# EAGLE design CCM_0020_two_channel_translator (EAGLE 9.5.1)

## Sheet 1 of 3: channel 1
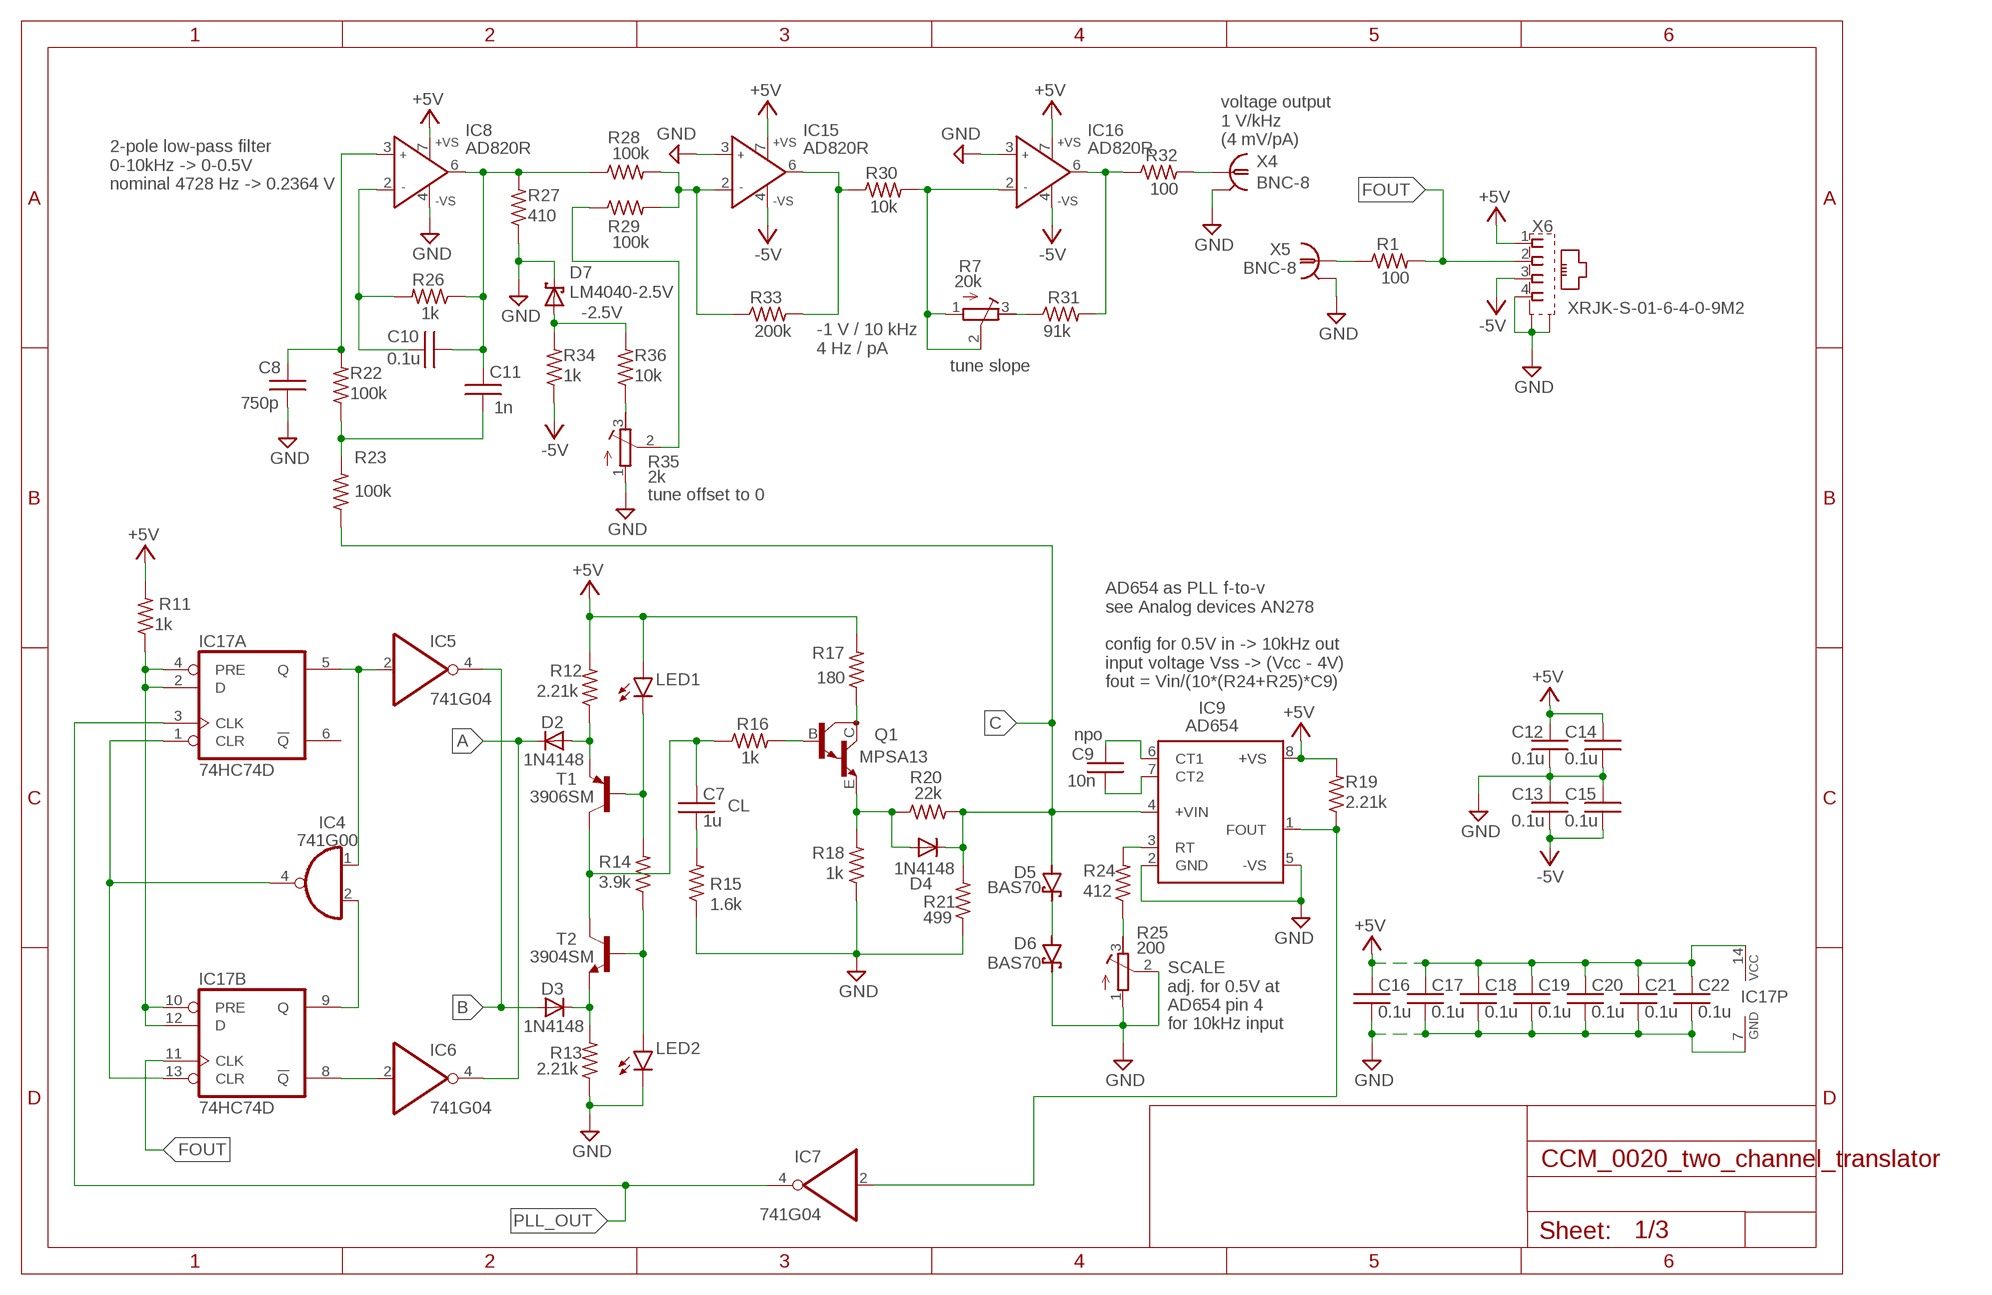
[diagram p0: schematic, sheet 1]

### Parts
C7  1u  C0603  [0603]
C8  750p  C0603  [0603]
C9  10n  C0603  [0603]
C10  0.1u  C0603  [0603]
C11  1n  C0603  [0603]
C12  0.1u  C0603  [0603]
C13  0.1u  C0603  [0603]
C14  0.1u  C0603  [0603]
C15  0.1u  C0603  [0603]
C16  0.1u  C0603  [0603]
C17  0.1u  C0603  [0603]
C18  0.1u  C0603  [0603]
C19  0.1u  C0603  [0603]
C20  0.1u  C0603  [0603]
C21  0.1u  C0603  [0603]
C22  0.1u  C0603  [0603]
D2  1N4148  [SOD323_ST]
D3  1N4148  [SOD323_ST]
D4  1N4148  [SOD323_ST]
D5  BAS70  [SOT23]
D6  BAS70  [SOT23]
D7  LM4040-2.5V  LM4040  [SOT23]
IC4  741G00  74AHC1G00DBV  [SOT23-5]
IC5  741G04  74AHC1G04DBV  [SOT23-5]
IC6  741G04  74AHC1G04DBV  [SOT23-5]
IC7  741G04  74AHC1G04DBV  [SOT23-5]
IC8  AD820R  [SO8]
IC9  AD654  [SO08]
IC15  AD820R  [SO8]
IC16  AD820R  [SO8]
IC17  74HC74D  [SO14]
LED1  LEDCHIP-LED0603  [CHIP-LED0603]
LED2  LEDCHIP-LED0603  [CHIP-LED0603]
Q1  MPSA13  MMBTA13LT1  [SOT23-BEC]
R1  100  R0603  [0603]
R7  20k  R-TRIMM64Y  [RTRIM64Y]
R11  1k  R0603  [0603]
R12  2.21k  R0603  [0603]
R13  2.21k  R0603  [0603]
R14  3.9k  R0603  [0603]
R15  1.6k  R0603  [0603]
R16  1k  R0603  [0603]
R17  180  R0603  [0603]
R18  1k  R0603  [0603]
R19  2.21k  R0603  [0603]
R20  22k  R0603  [0603]
R21  499  R0603  [0603]
R22  100k  R0603  [0603]
R23  100k  R0603  [0603]
R24  412  R0603  [0603]
R25  200  R-TRIMM64Y  [RTRIM64Y]
R26  1k  R0603  [0603]
R27  410  R0603  [0603]
R28  100k  R0603  [0603]
R29  100k  R0603  [0603]
R30  10k  R0603  [0603]
R31  91k  R0603  [0603]
R32  100  R0603  [0603]
R33  200k  R0603  [0603]
R34  1k  R0603  [0603]
R35  2k  R-TRIMM64Y  [RTRIM64Y]
R36  10k  R0603  [0603]
T1  3906SM  MMBT3906LT1-PNP-SOT23-BEC  [SOT23-BEC]
T2  3904SM  [SOT23]
X4  BNC-8  [BNC_RA]
X5  BNC-8  [BNC_RA]
X6  XRJK-S-01-6-4-0-9M2  [XRJK-S-01-6-4-0-9M2]

### Nets
+5V: C12.2 C14.2 C16.1 C17.1 C18.1 C19.1 C20.1 C21.1 C22.1 IC8.7(+VS) IC9.8(+VS) IC15.7(+VS) IC16.7(+VS) IC17.14(P:VCC) LED1.A R11.2 R12.2 R17.2 R19.2 X6.1 ; also sheet 2,3
-5V: C13.1 C15.1 IC15.4(-VS) IC16.4(-VS) R34.1 X6.3 ; also sheet 2,3
A: D2.C IC6.4(O)
B: D3.A IC5.4(O)
C: D4.C D5.1(A) IC9.4(+VIN) R20.2 R21.2 R23.1
FOUT: IC17.11(B:CLK) R1.2 X6.2
GND: C8.1 C12.1 C13.2 C14.1 C15.2 C16.2 C17.2 C18.2 C19.2 C20.2 C21.2 C22.2 D6.3(C) D7.1(C) IC8.4(-VS) IC9.2(GND) IC9.5(-VS) IC15.3(IN+) IC16.3(IN+) IC17.7(P:GND) LED2.C R13.1 R15.1 R18.1 R21.1 R25.1(A) R25.2(S) R27.1 R35.1(A) X4.2 X5.2 X6.4 X6.S1(S) X6.S2(S) ; also sheet 2,3
N$1: C9.1 IC9.6(CT1)
N$2: R1.1 X5.1
N$7: IC4.4(O) IC17.1(A:CLR) IC17.13(B:CLR)
N$9: R7.3(E) R31.1
N$10: IC4.2(I1) IC17.9(B:Q)
N$12: IC6.2(I) IC17.8(B:!Q)
N$13: C11.1 R22.1 R23.2
N$15: IC4.1(I0) IC5.2(I) IC17.5(A:Q)
N$16: C8.2 IC8.3(IN+) R22.2
N$17: C9.2 IC9.7(CT2)
N$18: R24.1 R25.3(E)
N$19: D5.3(C) D6.1(A)
N$20: C7.1 R16.1 T1.C T2.3(C)
N$21: D3.C R13.2 T2.2(E)
N$23: LED1.C R14.2 T1.B
N$24: LED2.A R14.1 T2.1(B)
N$25: C7.2 R15.2
N$26: Q1.C R17.1
N$27: Q1.B R16.2
N$28: D4.A Q1.E R18.2 R20.1
N$29: IC9.3(RT) R24.2
N$30: IC7.2(I) IC9.1(FOUT) R19.1
N$31: C10.2 C11.2 IC8.6(OUT) R26.1 R27.2 R28.1
N$32: C10.1 IC8.2(IN-) R26.2
N$33: IC15.2(IN-) R28.2 R29.2 R33.1
N$34: IC16.6(OUT) R31.2 R32.1
N$35: IC16.2(IN-) R7.1(A) R7.2(S) R30.2
N$36: R32.2 X4.1
N$37: IC15.6(OUT) R30.1 R33.2
N$38: D7.2(A) R34.2 R36.2
N$39: R29.1 R35.2(S)
N$40: R35.3(E) R36.1
N$41: D2.A R12.1 T1.E
N$69: IC17.2(A:D) IC17.4(A:PRE) IC17.10(B:PRE) IC17.12(B:D) R11.1
PLL_OUT: IC7.4(O) IC17.3(A:CLK)
Unconnected: IC17.6(A:!Q)

### Notes on the sheet
- voltage output
  1 V/kHz
  (4 mV/pA)
- 2-pole low-pass filter
  0-10kHz -> 0-0.5V
  nominal 4728 Hz -> 0.2364 V
- -2.5V
- -1 V / 10 kHz
  4 Hz / pA
- tune slope
- tune offset to 0
- AD654 as PLL f-to-v
  see Analog devices AN278
  
  config for 0.5V in -> 10kHz out
  input voltage Vss -> (Vcc - 4V)
  fout = Vin/(10*(R24+R25)*C9)
- npo
- CL
- SCALE
  adj. for 0.5V at 
  AD654 pin 4
  for 10kHz input

## Sheet 2 of 3: channel 2
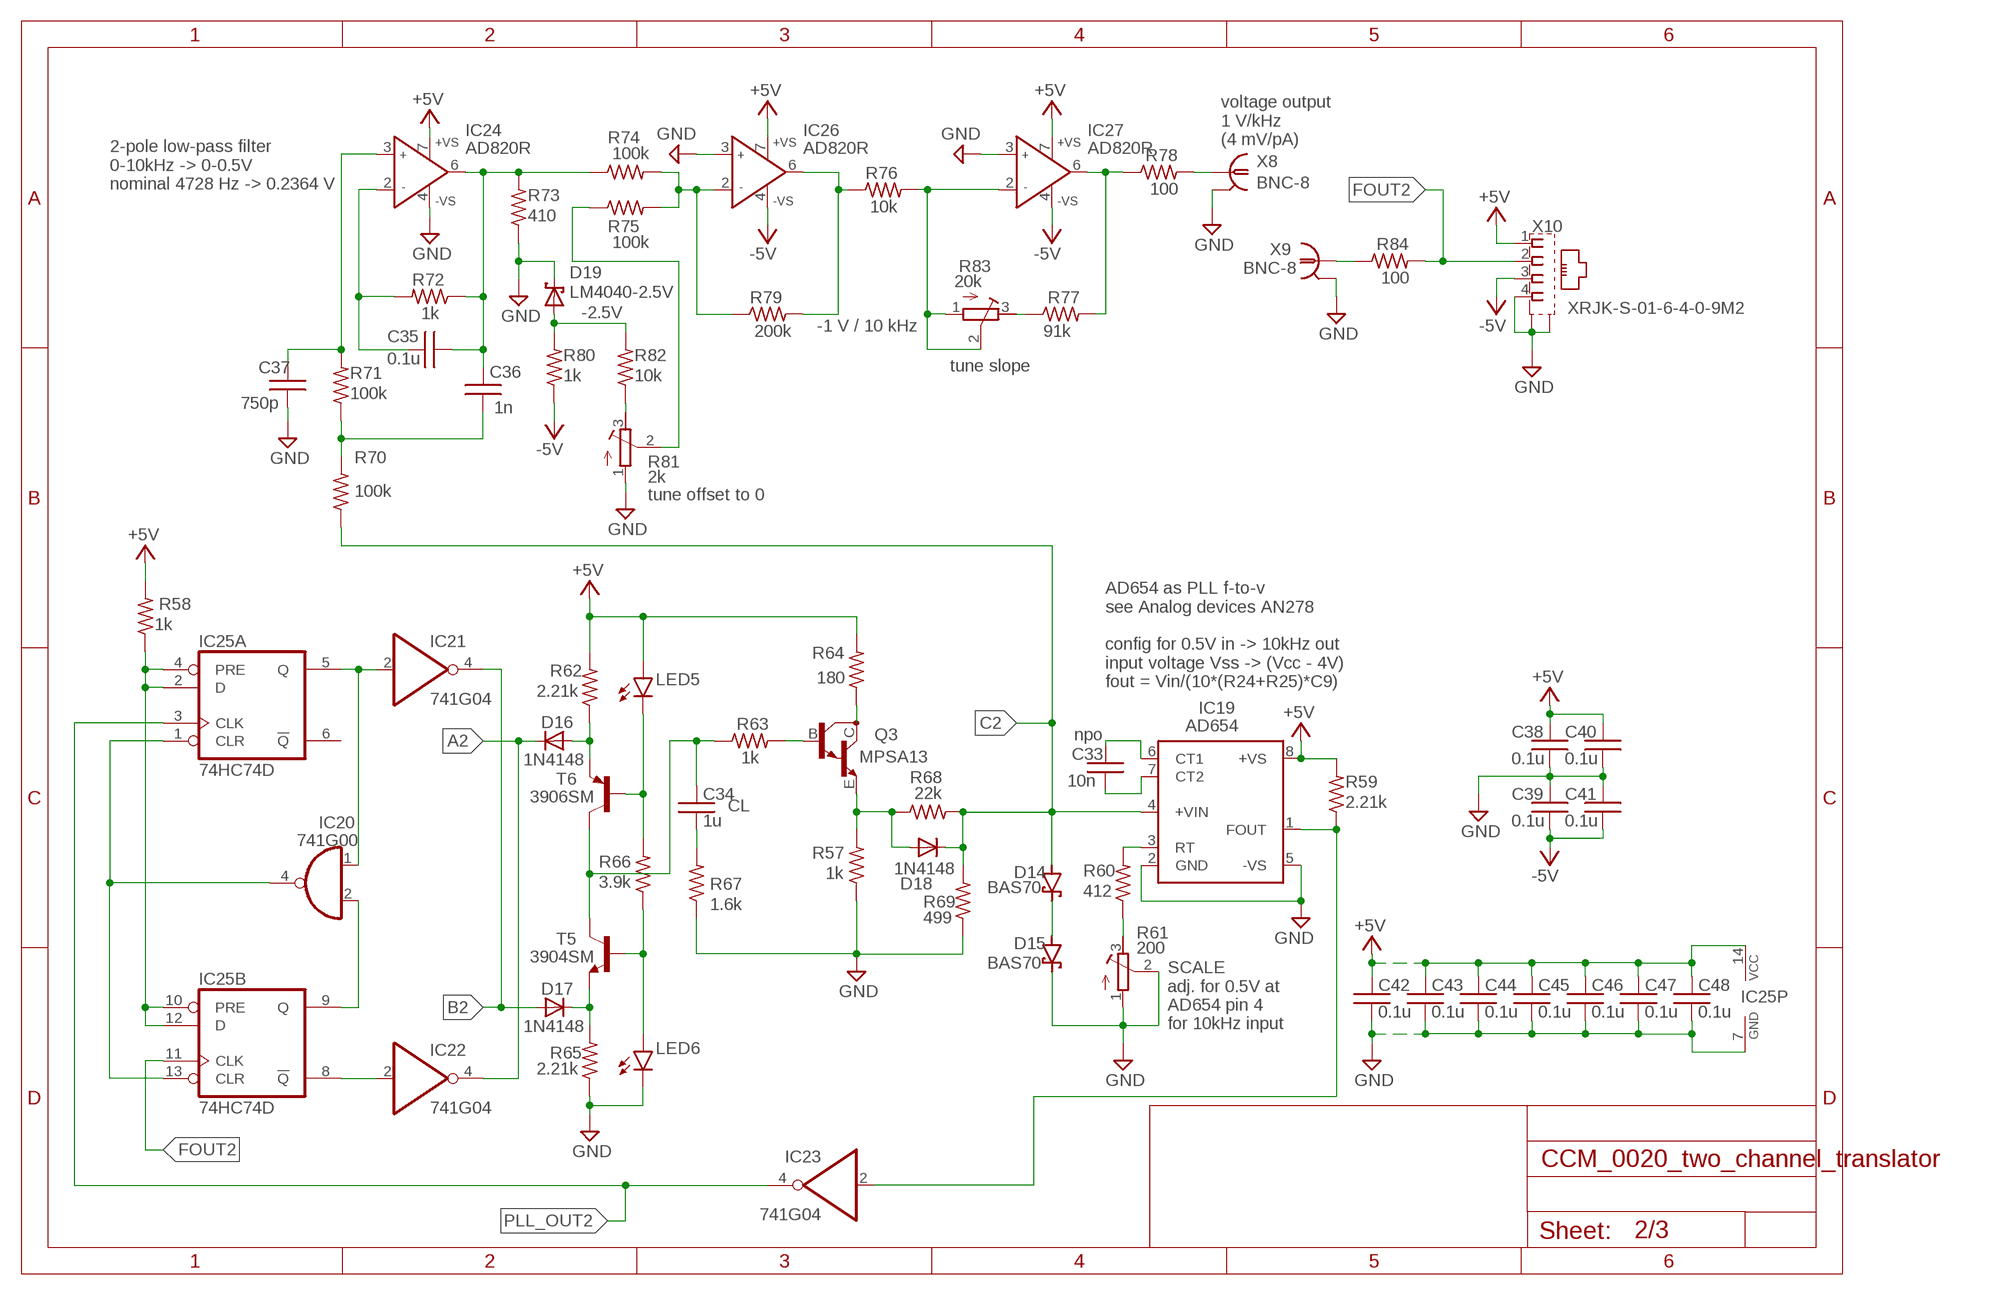
[diagram p1: schematic, sheet 2]

### Parts
C33  10n  C0603  [0603]
C34  1u  C0603  [0603]
C35  0.1u  C0603  [0603]
C36  1n  C0603  [0603]
C37  750p  C0603  [0603]
C38  0.1u  C0603  [0603]
C39  0.1u  C0603  [0603]
C40  0.1u  C0603  [0603]
C41  0.1u  C0603  [0603]
C42  0.1u  C0603  [0603]
C43  0.1u  C0603  [0603]
C44  0.1u  C0603  [0603]
C45  0.1u  C0603  [0603]
C46  0.1u  C0603  [0603]
C47  0.1u  C0603  [0603]
C48  0.1u  C0603  [0603]
D14  BAS70  [SOT23]
D15  BAS70  [SOT23]
D16  1N4148  [SOD323_ST]
D17  1N4148  [SOD323_ST]
D18  1N4148  [SOD323_ST]
D19  LM4040-2.5V  LM4040  [SOT23]
IC19  AD654  [SO08]
IC20  741G00  74AHC1G00DBV  [SOT23-5]
IC21  741G04  74AHC1G04DBV  [SOT23-5]
IC22  741G04  74AHC1G04DBV  [SOT23-5]
IC23  741G04  74AHC1G04DBV  [SOT23-5]
IC24  AD820R  [SO8]
IC25  74HC74D  [SO14]
IC26  AD820R  [SO8]
IC27  AD820R  [SO8]
LED5  LEDCHIP-LED0603  [CHIP-LED0603]
LED6  LEDCHIP-LED0603  [CHIP-LED0603]
Q3  MPSA13  MMBTA13LT1  [SOT23-BEC]
R57  1k  R0603  [0603]
R58  1k  R0603  [0603]
R59  2.21k  R0603  [0603]
R60  412  R0603  [0603]
R61  200  R-TRIMM64Y  [RTRIM64Y]
R62  2.21k  R0603  [0603]
R63  1k  R0603  [0603]
R64  180  R0603  [0603]
R65  2.21k  R0603  [0603]
R66  3.9k  R0603  [0603]
R67  1.6k  R0603  [0603]
R68  22k  R0603  [0603]
R69  499  R0603  [0603]
R70  100k  R0603  [0603]
R71  100k  R0603  [0603]
R72  1k  R0603  [0603]
R73  410  R0603  [0603]
R74  100k  R0603  [0603]
R75  100k  R0603  [0603]
R76  10k  R0603  [0603]
R77  91k  R0603  [0603]
R78  100  R0603  [0603]
R79  200k  R0603  [0603]
R80  1k  R0603  [0603]
R81  2k  R-TRIMM64Y  [RTRIM64Y]
R82  10k  R0603  [0603]
R83  20k  R-TRIMM64Y  [RTRIM64Y]
R84  100  R0603  [0603]
T5  3904SM  [SOT23]
T6  3906SM  MMBT3906LT1-PNP-SOT23-BEC  [SOT23-BEC]
X8  BNC-8  [BNC_RA]
X9  BNC-8  [BNC_RA]
X10  XRJK-S-01-6-4-0-9M2  [XRJK-S-01-6-4-0-9M2]

### Nets
+5V: C38.2 C40.2 C42.1 C43.1 C44.1 C45.1 C46.1 C47.1 C48.1 IC19.8(+VS) IC24.7(+VS) IC25.14(P:VCC) IC26.7(+VS) IC27.7(+VS) LED5.A R58.2 R59.2 R62.2 R64.2 X10.1 ; also sheet 1,3
-5V: C39.1 C41.1 IC26.4(-VS) IC27.4(-VS) R80.1 X10.3 ; also sheet 1,3
A2: D16.C IC22.4(O)
B2: D17.A IC21.4(O)
C2: D14.1(A) D18.C IC19.4(+VIN) R68.2 R69.2 R70.1
FOUT2: IC25.11(B:CLK) R84.2 X10.2
GND: C37.1 C38.1 C39.2 C40.1 C41.2 C42.2 C43.2 C44.2 C45.2 C46.2 C47.2 C48.2 D15.3(C) D19.1(C) IC19.2(GND) IC19.5(-VS) IC24.4(-VS) IC25.7(P:GND) IC26.3(IN+) IC27.3(IN+) LED6.C R57.1 R61.1(A) R61.2(S) R65.1 R67.1 R69.1 R73.1 R81.1(A) X8.2 X9.2 X10.4 X10.S1(S) X10.S2(S) ; also sheet 1,3
N$68: IC20.4(O) IC25.1(A:CLR) IC25.13(B:CLR)
N$70: IC20.2(I1) IC25.9(B:Q)
N$71: IC22.2(I) IC25.8(B:!Q)
N$72: IC20.1(I0) IC21.2(I) IC25.5(A:Q)
N$73: R60.1 R61.3(E)
N$74: D14.3(C) D15.1(A)
N$75: C34.1 R63.1 T5.3(C) T6.C
N$76: D17.C R65.2 T5.2(E)
N$77: LED5.C R66.2 T6.B
N$78: LED6.A R66.1 T5.1(B)
N$79: C34.2 R67.2
N$80: Q3.C R64.1
N$81: Q3.B R63.2
N$82: D18.A Q3.E R57.2 R68.1
N$83: IC19.3(RT) R60.2
N$84: C33.1 IC19.6(CT1)
N$85: C33.2 IC19.7(CT2)
N$86: IC19.1(FOUT) IC23.2(I) R59.1
N$87: C36.1 R70.2 R71.1
N$88: C37.2 IC24.3(IN+) R71.2
N$89: C35.2 C36.2 IC24.6(OUT) R72.1 R73.2 R74.1
N$90: C35.1 IC24.2(IN-) R72.2
N$91: IC26.2(IN-) R74.2 R75.2 R79.1
N$92: IC27.2(IN-) R76.2 R83.1(A) R83.2(S)
N$93: IC27.6(OUT) R77.2 R78.1
N$94: R78.2 X8.1
N$95: IC26.6(OUT) R76.1 R79.2
N$96: D19.2(A) R80.2 R82.2
N$97: R75.1 R81.2(S)
N$98: R81.3(E) R82.1
N$99: R77.1 R83.3(E)
N$100: D16.A R62.1 T6.E
N$101: R84.1 X9.1
N$102: IC25.2(A:D) IC25.4(A:PRE) IC25.10(B:PRE) IC25.12(B:D) R58.1
PLL_OUT2: IC23.4(O) IC25.3(A:CLK)
Unconnected: IC25.6(A:!Q)

### Notes on the sheet
- voltage output
  1 V/kHz
  (4 mV/pA)
- 2-pole low-pass filter
  0-10kHz -> 0-0.5V
  nominal 4728 Hz -> 0.2364 V
- -2.5V
- -1 V / 10 kHz
- tune slope
- tune offset to 0
- AD654 as PLL f-to-v
  see Analog devices AN278
  
  config for 0.5V in -> 10kHz out
  input voltage Vss -> (Vcc - 4V)
  fout = Vin/(10*(R24+R25)*C9)
- npo
- CL
- SCALE
  adj. for 0.5V at 
  AD654 pin 4
  for 10kHz input

## Sheet 3 of 3: rack mount bus
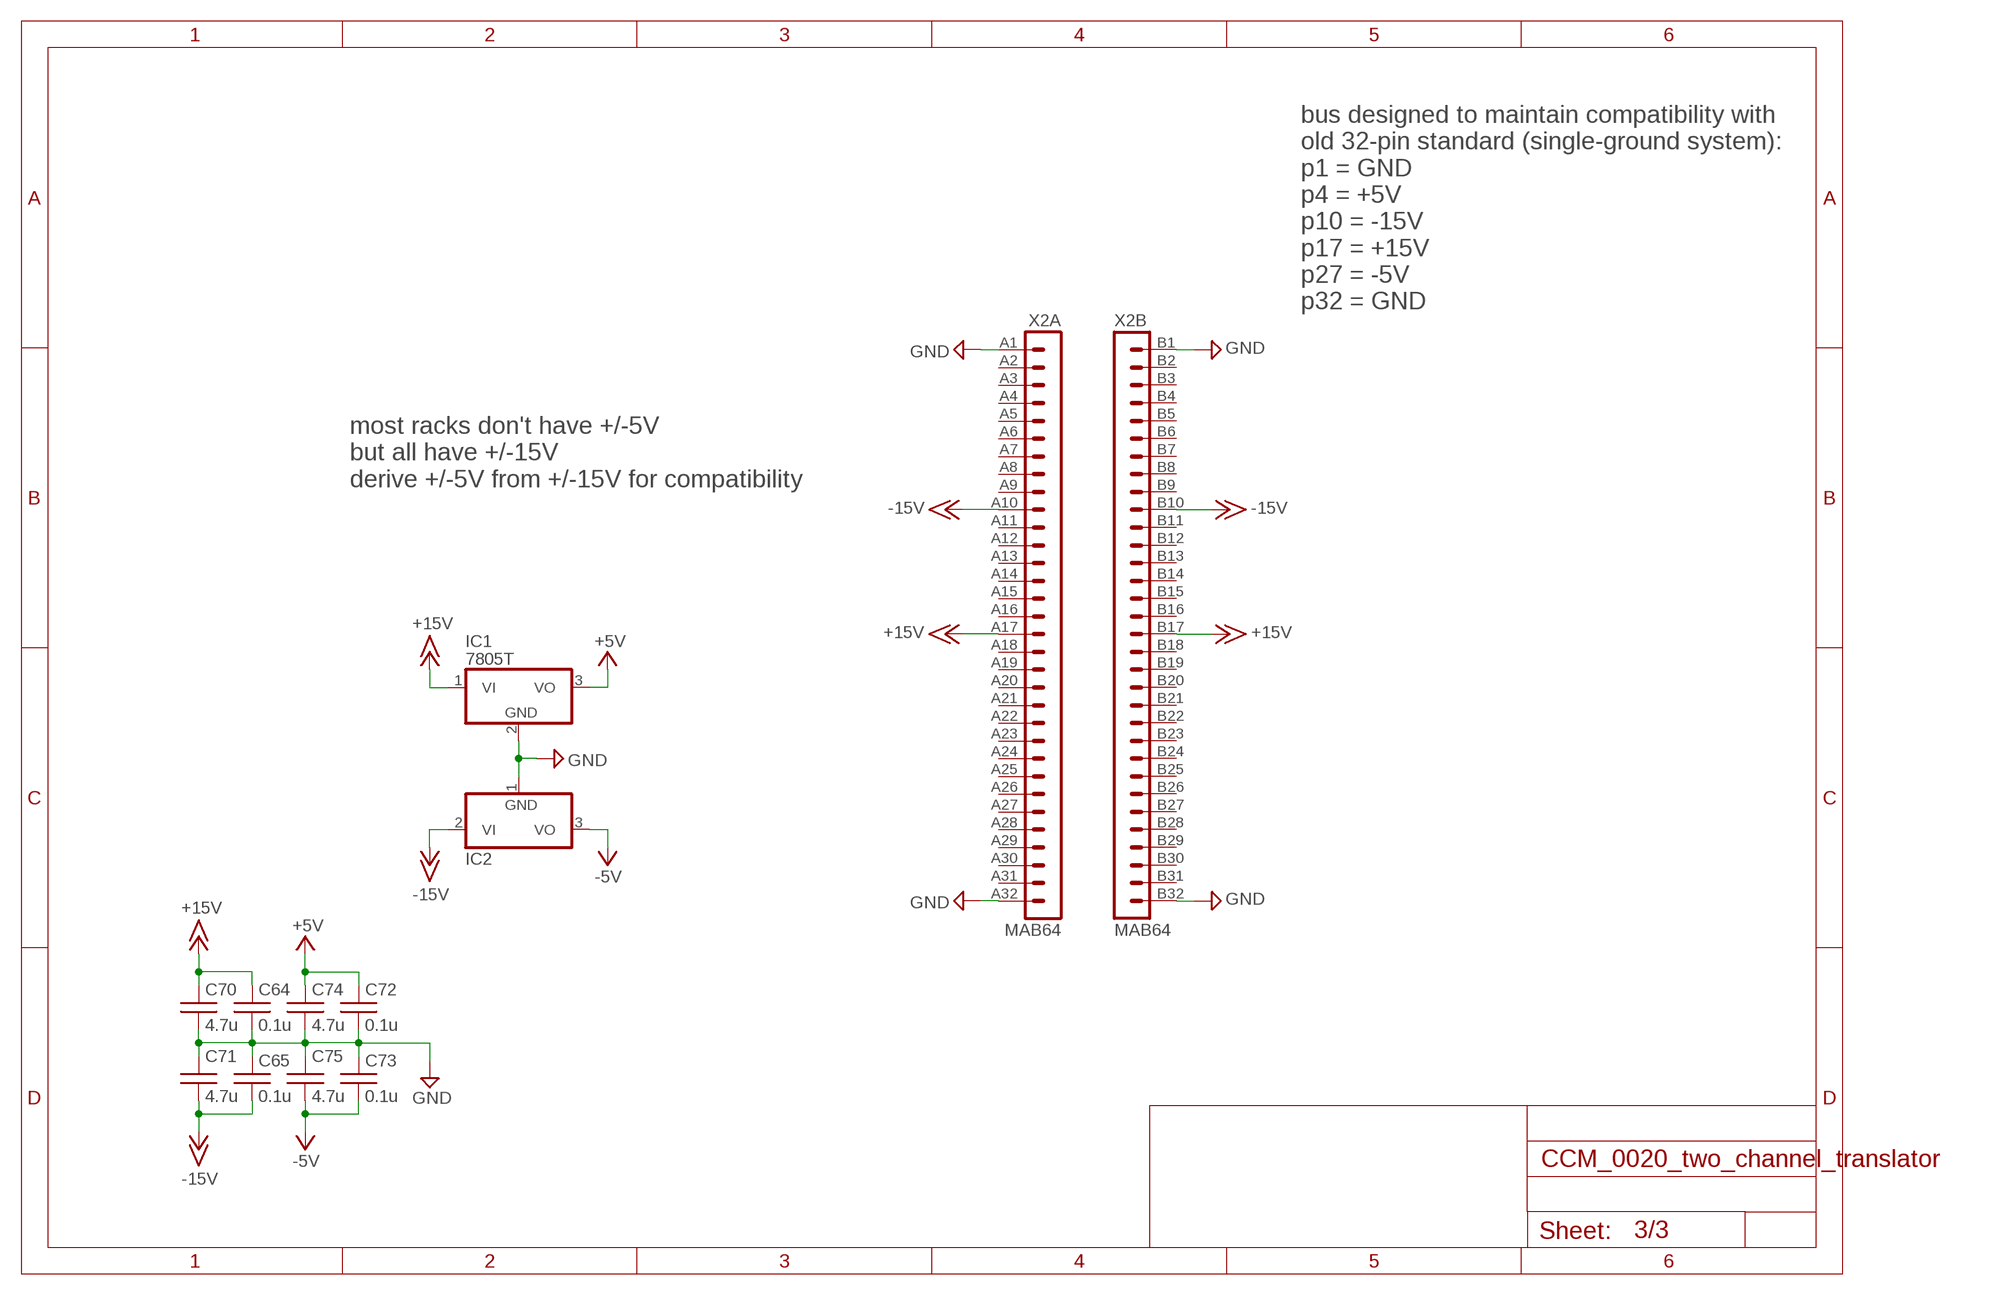
[diagram p2: schematic, sheet 3]

### Parts
C64  0.1u  C0603  [0603]
C65  0.1u  C0603  [0603]
C70  4.7u  C0603  [0603]
C71  4.7u  C0603  [0603]
C72  0.1u  C0603  [0603]
C73  0.1u  C0603  [0603]
C74  4.7u  C0603  [0603]
C75  4.7u  C0603  [0603]
IC1  7805T  [TO220H]
IC2  7905T  [TO220H]
X2  MAB64  [MAB64]

### Nets
+5V: C72.1 C74.1 IC1.3(VO) ; also sheet 1,2
+15V: C64.1 C70.1 IC1.1(VI) X2.A17 X2.B17
-5V: C73.2 C75.2 IC2.3(VO) ; also sheet 1,2
-15V: C65.2 C71.2 IC2.2(VI) X2.A10 X2.B10
GND: C64.2 C65.1 C70.2 C71.1 C72.2 C73.1 C74.2 C75.1 IC1.2(GND) IC2.1(GND) X2.A1 X2.A32 X2.B1 X2.B32 ; also sheet 1,2
Unconnected: X2.A2 X2.A3 X2.A4 X2.A5 X2.A6 X2.A7 X2.A8 X2.A9 X2.A11 X2.A12 X2.A13 X2.A14 X2.A15 X2.A16 X2.A18 X2.A19 X2.A20 X2.A21 X2.A22 X2.A23 X2.A24 X2.A25 X2.A26 X2.A27 X2.A28 X2.A29 X2.A30 X2.A31 X2.B2 X2.B3 X2.B4 X2.B5 X2.B6 X2.B7 X2.B8 X2.B9 X2.B11 X2.B12 X2.B13 X2.B14 X2.B15 X2.B16 X2.B18 X2.B19 X2.B20 X2.B21 X2.B22 X2.B23 X2.B24 X2.B25 X2.B26 X2.B27 X2.B28 X2.B29 X2.B30 X2.B31

### Notes on the sheet
- bus designed to maintain compatibility with 
  old 32-pin standard (single-ground system):
  p1 = GND
  p4 = +5V
  p10 = -15V
  p17 = +15V
  p27 = -5V
  p32 = GND
- most racks don't have +/-5V
  but all have +/-15V
  derive +/-5V from +/-15V for compatibility

## Power pins joined to a net without a drawn wire
+5V: IC4.5(VCC) IC5.5(VCC) IC6.5(VCC) IC7.5(VCC) IC20.5(VCC) IC21.5(VCC) IC22.5(VCC) IC23.5(VCC)
GND: IC4.3(GND) IC5.3(GND) IC6.3(GND) IC7.3(GND) IC20.3(GND) IC21.3(GND) IC22.3(GND) IC23.3(GND)

## Library data of the parts
C7-C22 C33-C48 C64 C65 C70-C75 = acrooptics:C: Capacitor
D2-D4 D16-D18 = custom_parts:1N4148: DIODE high speed (Philips)
D5 D6 D14 D15 = diode:BAS70: Silicon Schottky Diodes General-purpose diode for high-speed switching
D7 D19 = noah:LM4040: LM4040 Reference Zener Diode
IC1 = linear:78*: Positive VOLTAGE REGULATOR Source: http://cache.national.com/ds/LM/LM78L05.pdf http://www.fairchildsemi.com/ds/LM/LM7805.pdf
IC2 = linear:79*: Negative VOLTAGE REGULATOR
IC4 IC20 = 74xx-little-de:74*1G00: 2-input NAND gate
IC5-IC7 IC21-IC23 = 74xx-little-de:74*1G04: INVERTER Gate
IC8 IC15 IC16 IC24 IC26 IC27 = analog-devices:AD820: Single-Supply, Rail-to-Rail, Low Power, FET Input Op Amp Source: http://www.analog.com/static/imported-files/data_sheets/AD820.pdf; OC_FARNELL: 1838867; OC_NEWARK: unknown
IC9 IC19 = noah:AD654: Low Cost Monolithic Voltage-to-Frequency Converter
IC17 IC25 = 74xx-eu:74*74: Dual D type positive edge triggered FLIP FLOP, preset and clear
LED1 LED2 LED5 LED6 = led:LED: LED OSRAM: - CHIPLED LG R971, LG N971, LY N971, LG Q971, LY Q971, LO R971, LY R971 LH N974, LH R974 LS Q976, LO Q976, LY Q976 LO Q996 - Hyper CHIPLED LW Q18S LB Q993, LB Q99A, LB R99A - SideLED LS A670, LO A670, LY A670, LG A670, LP A670 LB A673, LV A673, LT A673, LW A673 LH A674 LY A675 LS A676, LA A676, LO A676, LY A676, LW A676 LS A679, LY A679, LG A679 - Hyper Micro SIDELED® LS Y876, LA Y876, LO Y876, LY Y876 LT Y87S - SmartLED LW L88C, LW L88S LB L89C, LB L89S, LG L890 LS L89K, LO L89K, LY L89K LS L896, LA L896, LO L896, LY L896 - TOPLED LS T670, LO T670, LY T670, LG T670, LP T670 LSG T670, LSP T670, LSY T670, LOP T670, LYG T670 LG T671, LOG T671, LSG T671 LB T673, LV T673, LT T673, LW T673 LH T674 LS T676, LA T676, LO T676, LY T676, LB T676, LH T676, LSB T676, LW T676 LB T67C, LV T67C, LT T67C, LS T67K, LO T67K, LY T67K, LW E67C LS E67B, LA E67B, LO E67B, LY E67B, LB E67C, LV E67C, LT E67C LW T67C LS T679, LY T679, LG T679 LS T770, LO T770, LY T770, LG T770, LP T770 LB T773, LV T773, LT T773, LW T773 LH T774 LS E675, LA E675, LY E675, LS T675 LS T776, LA T776, LO T776, LY T776, LB T776 LHGB T686 LT T68C, LB T68C - Hyper Mini TOPLED® LB M676 - Mini TOPLED Santana® LG M470 LS M47K, LO M47K, LY M47K Source: http://www.osram.convergy.de LUXEON: - LUMILED® LXK2-PW12-R00, LXK2-PW12-S00, LXK2-PW14-U00, LXK2-PW14-V00 LXK2-PM12-R00, LXK2-PM12-S00, LXK2-PM14-U00 LXK2-PE12-Q00, LXK2-PE12-R00, LXK2-PE12-S00, LXK2-PE14-T00, LXK2-PE14-U00 LXK2-PB12-K00, LXK2-PB12-L00, LXK2-PB12-M00, LXK2-PB14-N00, LXK2-PB14-P00, LXK2-PB14-Q00 LXK2-PR12-L00, LXK2-PR12-M00, LXK2-PR14-Q00, LXK2-PR14-R00 LXK2-PD12-Q00, LXK2-PD12-R00, LXK2-PD12-S00 LXK2-PH12-R00, LXK2-PH12-S00 LXK2-PL12-P00, LXK2-PL12-Q00, LXK2-PL12-R00 Source: www.luxeon.com KINGBRIGHT: KA-3528ASYC Source: www.kingbright.com
Q1 Q3 = transistor-npn:MMBTA13*: NPN Darlington Transistor
R1 R11-R24 R26-R34 R36 R57-R60 R62-R80 R82 R84 = acrooptics:R: 0603 resistor
R7 R25 R35 R61 R81 R83 = rcl:R-TRIMM: Trimm resistor; SPICEMODEL: X; SPICEPREFIXL: POT
T1 T6 = transistor:*-PNP-: PNP Transistror
T2 T5 = noah:3904: NPN TRANSISTOR
X2 = noah:MAB64: CONNECTOR male, 94 pins, type B, rows AB, grid 2.54 mm
X4 X5 X8 X9 = noah:BNC: JACK, RIGHT ANGLE, 50 OHM, PCB, BNC Source: amp_227161.pdf; OC_FARNELL: unknown; OC_NEWARK: unknown
X6 X10 = con-xmultiple:XRJK*4: RJ11 Connector without LED, 6 position, 4 contacts, thrue hole Source: XRJK-S-01-6-4-0-9M2(01).pdf

## Board
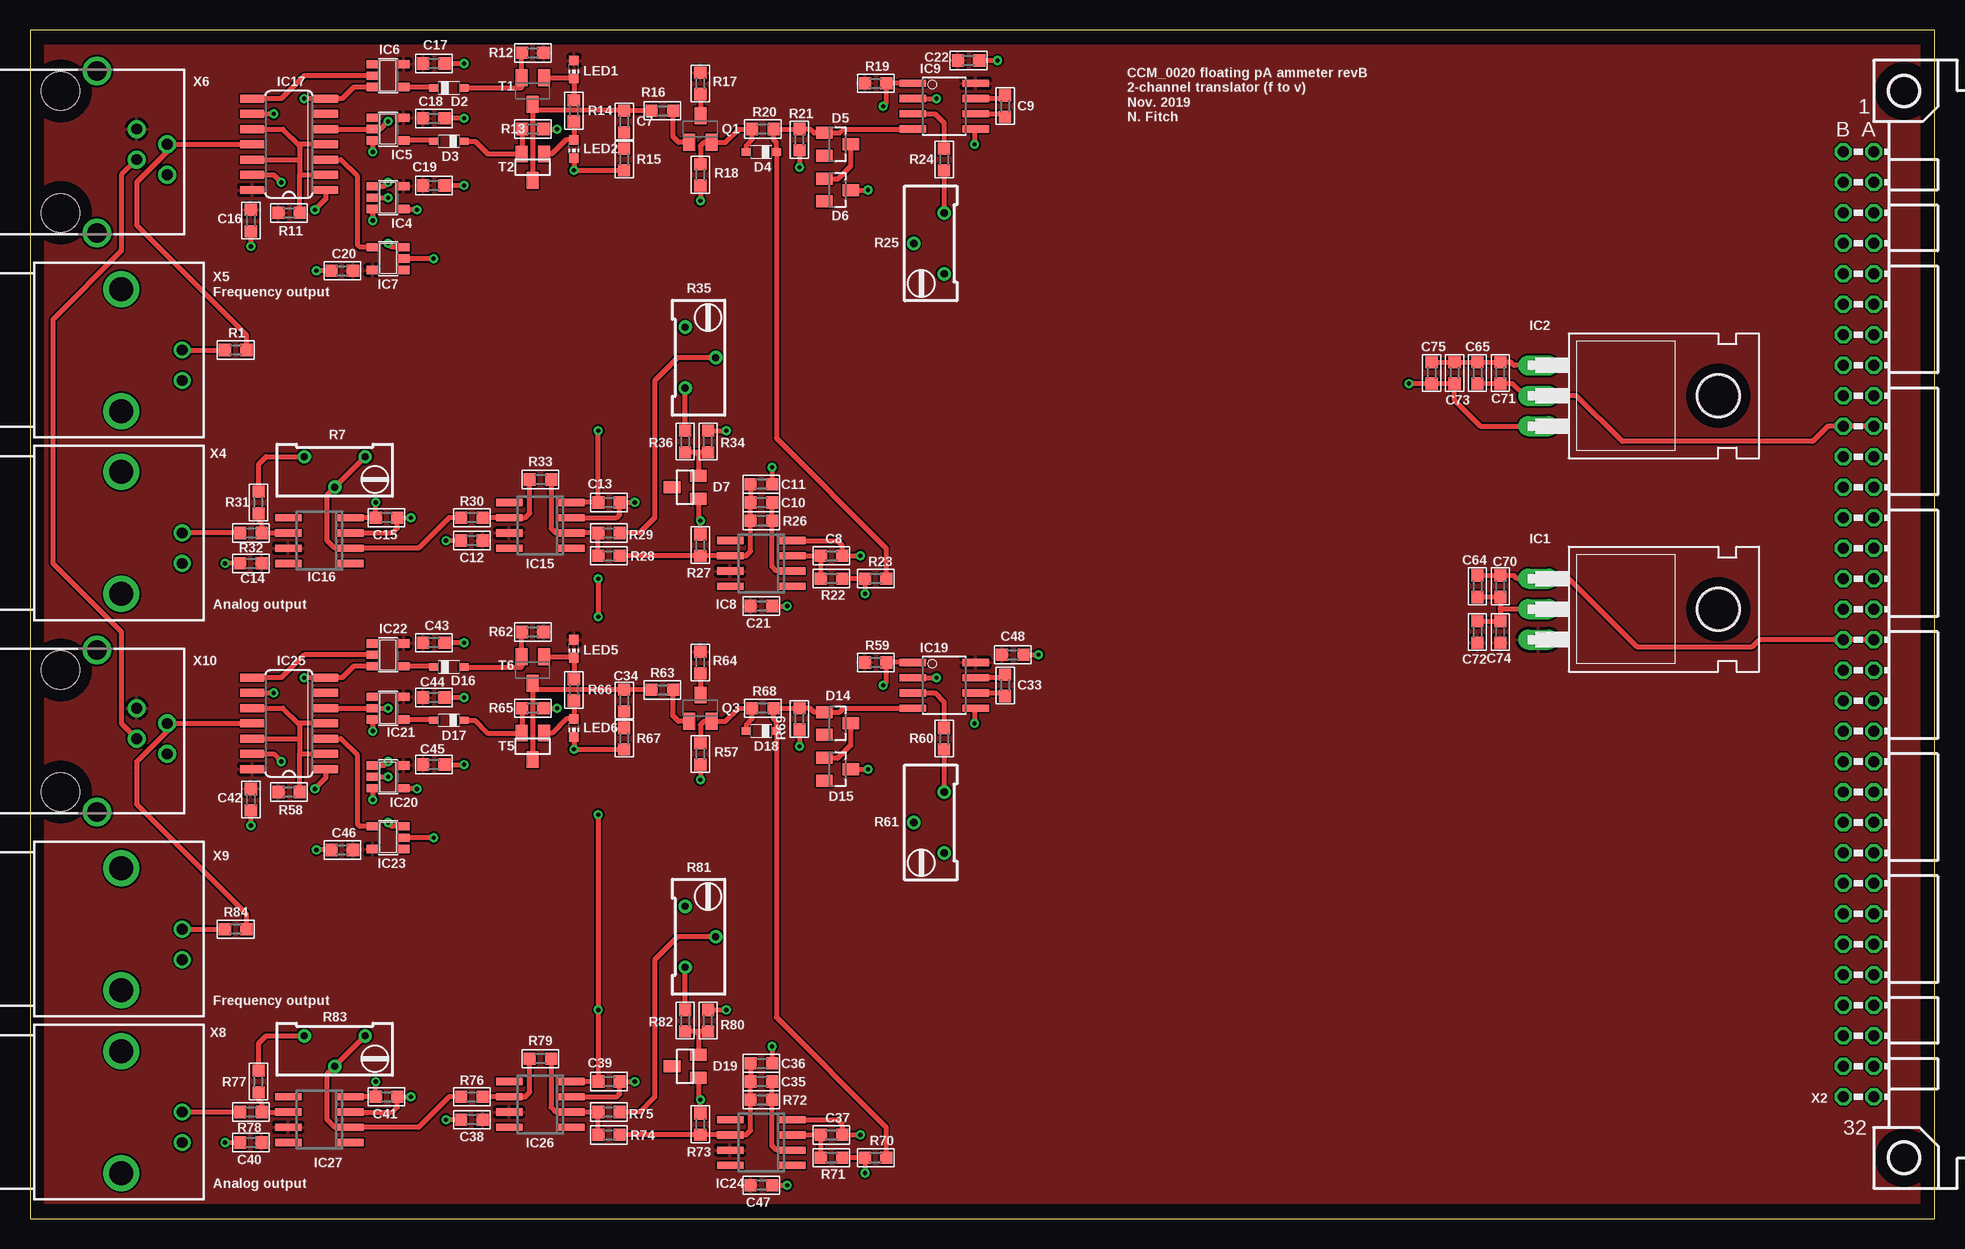
[diagram p3: board, top side]
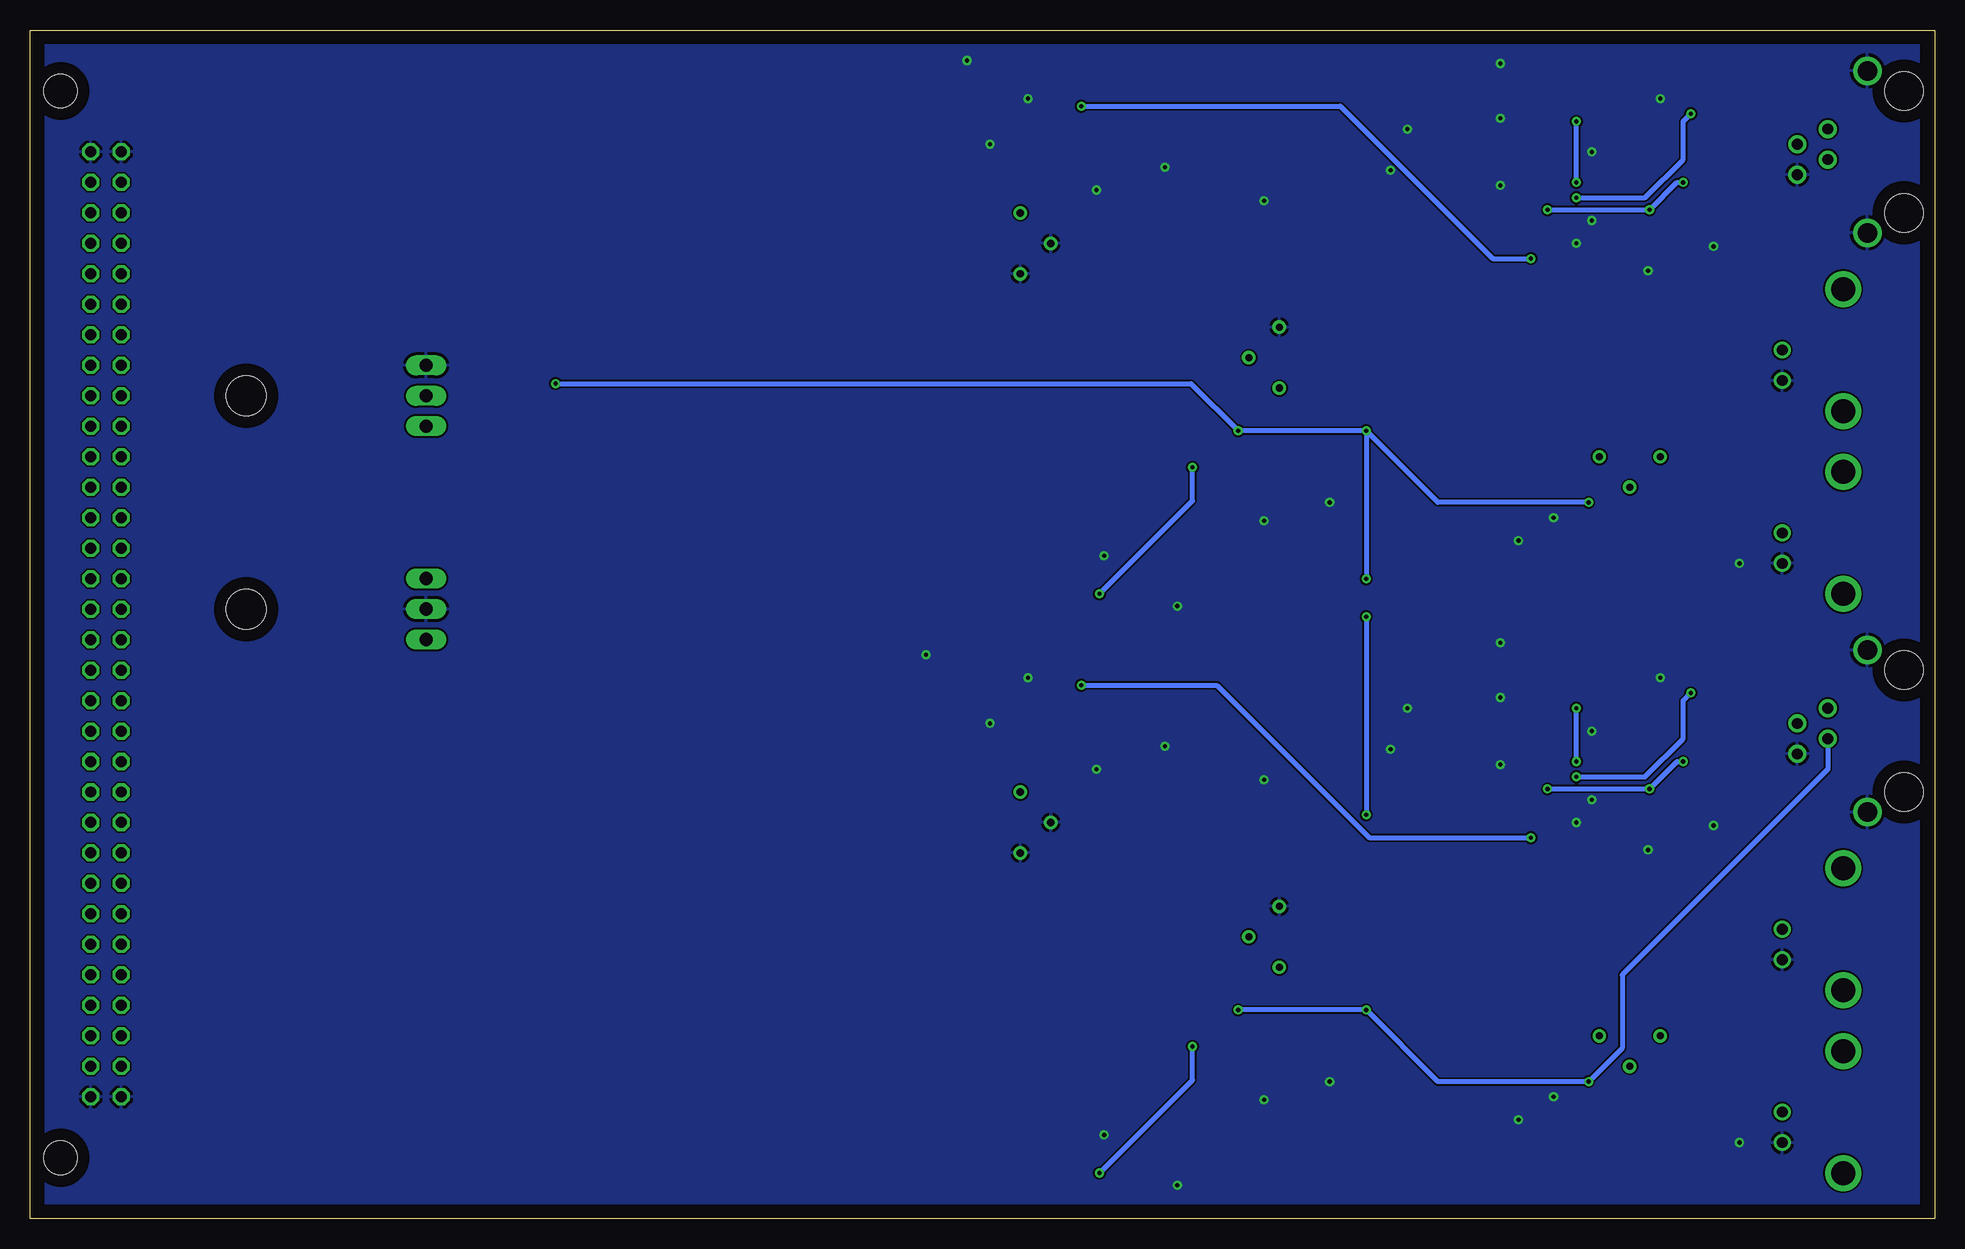
[diagram p4: board, bottom side, seen from below]

Size 158.75 x 99.06 mm. Coordinates in mm from the lower left corner, seen from the top.
Outline: 0,0 158.75,0 158.75,99.06 0,99.06 0,0
Copper layers (1*16): Top 0.035mm / dielectric 1.5mm / Bottom 0.035mm
Design rules "default *": minimum track width 6mil, minimum drill 0.35mm, track to track 6mil, track to pad 6mil, pad to pad 6mil, via to via 6mil, smd to smd 6mil, copper to edge 40mil, drill to drill 6mil, minimum pad ring 10mil, minimum via ring 8mil, stop-mask expansion 4mil, vias tented up to drill 0mil, thermal gap 10mil

### Footprints (pad centres in the part's own frame; a part is rotated, then mirrored left to right if it is on the bottom)
0603 = smd 1.016 x 1.016: 1 -0.889,0; 2 0.889,0
SOD323_ST = smd 0.8 x 0.6: A 1.25,0; C -1.25,0
SOT23 = smd 1 x 1.4: 1 -0.95,-1.1; 2 0.95,-1.1; 3 0,1.1
TO220H = drill 1.118 long: 1 -2.54,-10.16; 2 0,-10.16; 3 2.54,-10.16 | hole 3.302: 0,4.826
SOT23-5 = smd 0.69 x 0.99: 1 -0.95,-1.29; 2 0,-1.29; 3 0.95,-1.29; 4 0.95,1.3; 5 -0.95,1.3
SO8 = smd 0.6 x 2.2: 1 -1.905,-2.6; 2 -0.635,-2.6; 3 0.635,-2.6; 4 1.905,-2.6; 5 1.905,2.6; 6 0.635,2.6; 7 -0.635,2.6; 8 -1.905,2.6
SO08 = smd 0.61 x 2.21: 1 -1.905,-2.616; 2 -0.635,-2.616; 3 0.635,-2.616; 4 1.905,-2.616; 5 1.905,2.616; 6 0.635,2.616; 7 -0.635,2.616; 8 -1.905,2.616
SO14 = smd 0.66 x 2.032: 1 -3.81,-3.073; 2 -2.54,-3.073; 3 -1.27,-3.073; 4 0,-3.073; 5 1.27,-3.073; 6 2.54,-3.073; 7 3.81,-3.073; 8 3.81,3.073; 9 2.54,3.073; 10 1.27,3.073; 11 0,3.073; 12 -1.27,3.073; 13 -2.54,3.073; 14 -3.81,3.073
CHIP-LED0603 = smd 0.8 x 0.8: A 0,-0.75; C 0,0.75
SOT23-BEC = smd 1 x 1.4: B -0.95,-1.1; C 0,1.1; E 0.95,-1.1
RTRIM64Y = drill 0.61: 1 0,-2.54; 2 -2.54,0; 3 0,2.54
MAB64 = drill 0.914 octagon: A1 -2.54,39.37; A2 -2.54,36.83; A3 -2.54,34.29; A4 -2.54,31.75; A5 -2.54,29.21; A6 -2.54,26.67; A7 -2.54,24.13; A8 -2.54,21.59; A9 -2.54,19.05; A10 -2.54,16.51; A11 -2.54,13.97; A12 -2.54,11.43; A13 -2.54,8.89; A14 -2.54,6.35; A15 -2.54,3.81; A16 -2.54,1.27; A17 -2.54,-1.27; A18 -2.54,-3.81; A19 -2.54,-6.35; A20 -2.54,-8.89; A21 -2.54,-11.43; A22 -2.54,-13.97; A23 -2.54,-16.51; A24 -2.54,-19.05; A25 -2.54,-21.59; A26 -2.54,-24.13; A27 -2.54,-26.67; A28 -2.54,-29.21; A29 -2.54,-31.75; A30 -2.54,-34.29; A31 -2.54,-36.83; A32 -2.54,-39.37; B1 -5.08,39.37; B2 -5.08,36.83; B3 -5.08,34.29; B4 -5.08,31.75; B5 -5.08,29.21; B6 -5.08,26.67; B7 -5.08,24.13; B8 -5.08,21.59; B9 -5.08,19.05; B10 -5.08,16.51; B11 -5.08,13.97; B12 -5.08,11.43; B13 -5.08,8.89; B14 -5.08,6.35; B15 -5.08,3.81; B16 -5.08,1.27; B17 -5.08,-1.27; B18 -5.08,-3.81; B19 -5.08,-6.35; B20 -5.08,-8.89; B21 -5.08,-11.43; B22 -5.08,-13.97; B23 -5.08,-16.51; B24 -5.08,-19.05; B25 -5.08,-21.59; B26 -5.08,-24.13; B27 -5.08,-26.67; B28 -5.08,-29.21; B29 -5.08,-31.75; B30 -5.08,-34.29; B31 -5.08,-36.83; B32 -5.08,-39.37 | hole 2.794: 0,44.45; 0,-44.45
BNC_RA = drill 0.9 pad 1.27: 1 0,-5.08; 2 -2.54,-5.08 | drill 2: P$1 -5.08,0; P$2 5.08,0
XRJK-S-01-6-4-0-9M2 = drill 0.9 pad 1.5: 1 -1.905,6.35; 2 -0.635,8.89; 3 0.635,6.35; 4 1.905,8.89 | drill 1.6 pad 2.184: S1 -6.75,3.05; S2 6.75,3.05 | hole 3.2: -5.08,0; 5.08,0

### Placement (x,y rotation side)
C7  49.53,91.44 270 top
C8  66.8,55.24 180 top
C9  81.28,92.71 90 top
C10  60.96,59.69 180 top
C11  60.96,61.21 180 top
C12  36.83,56.52 0 top
C13  48.26,59.69 0 top
C14  18.41,54.61 0 top
C15  29.72,58.42 0 top
C16  18.41,83.19 270 top
C17  33.66,96.27 0 top
C18  33.66,91.69 0 top
C19  33.66,86.11 0 top
C20  26.04,78.99 180 top
C21  60.96,51.05 0 top
C22  78.23,96.52 0 top
C33  81.28,44.45 90 top
C34  49.53,43.18 270 top
C35  60.96,11.43 180 top
C36  60.96,12.95 180 top
C37  66.8,6.99 180 top
C38  36.83,8.26 0 top
C39  48.26,11.43 0 top
C40  18.41,6.35 0 top
C41  29.72,10.16 0 top
C42  18.41,34.92 270 top
C43  33.66,48.01 0 top
C44  33.66,43.43 0 top
C45  33.66,37.85 0 top
C46  26.04,30.73 180 top
C47  60.96,2.79 0 top
C48  81.92,46.99 0 top
C64  120.65,52.7 270 top
C65  120.65,70.48 270 top
C70  122.56,52.7 270 top
C71  122.56,70.48 270 top
C72  120.65,48.9 90 top
C73  118.75,70.48 270 top
C74  122.56,48.9 90 top
C75  116.84,70.48 270 top
D2  34.92,94.23 0 top
D3  34.92,89.79 180 top
D4  60.96,88.9 180 top
D5  67.31,89.53 270 top
D6  67.31,85.72 270 top
D7  54.61,60.96 90 top
D14  67.31,41.27 270 top
D15  67.31,37.47 270 top
D16  34.92,45.97 0 top
D17  34.92,41.53 180 top
D18  60.96,40.64 180 top
D19  54.61,12.7 90 top
IC1  135.89,50.8 270 top
IC2  135.89,68.58 270 top
IC4  29.84,85.09 270 top
IC5  29.84,90.81 270 top
IC6  29.84,95.25 270 top
IC7  29.84,80.01 90 top
IC8  60.96,54.61 90 top
IC9  76.2,92.71 270 top
IC15  42.55,57.78 90 top
IC16  24.13,56.52 90 top
IC17  21.59,89.53 90 top
IC19  76.2,44.45 270 top
IC20  29.84,36.83 270 top
IC21  29.84,42.55 270 top
IC22  29.84,46.99 270 top
IC23  29.84,31.75 90 top
IC24  60.96,6.35 90 top
IC25  21.59,41.27 90 top
IC26  42.55,9.53 90 top
IC27  24.13,8.26 90 top
LED1  45.34,95.76 180 top
LED2  45.34,89.15 180 top
LED5  45.34,47.5 180 top
LED6  45.34,40.89 180 top
Q1  55.88,90.81 0 top
Q3  55.88,42.55 0 top
R1  17.14,72.39 0 top
R7  25.4,63.5 90 top
R11  21.59,83.82 180 top
R12  41.91,97.16 0 top
R13  41.91,90.81 180 top
R14  45.34,92.33 90 top
R15  49.53,88.27 90 top
R16  52.7,92.33 0 top
R17  55.88,94.61 90 top
R18  55.88,87 90 top
R19  70.48,94.61 180 top
R20  61.09,90.81 0 top
R21  64.14,89.92 90 top
R22  66.8,53.34 180 top
R23  70.48,53.34 180 top
R24  76.2,88.27 90 top
R25  76.2,81.28 0 top
R26  60.96,58.17 0 top
R27  55.88,56.13 270 top
R28  48.26,55.24 180 top
R29  48.26,57.15 180 top
R30  36.83,58.42 180 top
R31  19.05,59.69 270 top
R32  18.41,57.15 180 top
R33  42.55,61.59 180 top
R34  56.52,64.77 270 top
R35  54.61,71.75 180 top
R36  54.61,64.77 270 top
R57  55.88,38.73 90 top
R58  21.59,35.56 180 top
R59  70.48,46.35 180 top
R60  76.2,40.01 90 top
R61  76.2,33.02 0 top
R62  41.91,48.9 0 top
R63  52.7,44.07 0 top
R64  55.88,46.35 90 top
R65  41.91,42.55 180 top
R66  45.34,44.07 90 top
R67  49.53,40.01 90 top
R68  61.09,42.55 0 top
R69  64.14,41.66 90 top
R70  70.48,5.08 180 top
R71  66.8,5.08 180 top
R72  60.96,9.91 0 top
R73  55.88,7.87 270 top
R74  48.26,6.99 180 top
R75  48.26,8.89 180 top
R76  36.83,10.16 180 top
R77  19.05,11.43 270 top
R78  18.41,8.89 180 top
R79  42.55,13.34 180 top
R80  56.52,16.51 270 top
R81  54.61,23.5 180 top
R82  54.61,16.51 270 top
R83  25.4,15.24 90 top
R84  17.14,24.13 0 top
T1  41.91,93.98 180 top
T2  41.91,87.63 180 top
T5  41.91,39.37 180 top
T6  41.91,45.72 180 top
X2  156.21,49.53 0 top
X4  7.62,57.15 90 top
X5  7.62,72.39 90 top
X6  2.54,88.9 270 top
X8  7.62,8.89 90 top
X9  7.62,24.13 90 top
X10  2.54,40.64 270 top

### Tracks (layer width: path | path; a pad name or v marks a point on that pad's centre or on a via)
+5V
  pour Top: 1.27,1.27 1.27,97.79 157.48,97.79 157.48,1.27
+15V
  Top 0.406: C64.1 C70.1 123.7,53.59 123.95,53.34 IC1.1 128.27,53.34 133.99,47.62 143.51,47.62 144.15,48.26 X2.B17 X2.A17
-5V  (via drill 0.35)
  Top 0.406: X6.3 7.62,87 7.62,80.64 1.91,74.93 1.91,54.61 7.62,48.9 7.62,41.27 X10.3 | v47.37,53.34 v47.37,50.16 | v47.37,33.66 v47.37,17.4 C39.1 IC26.4 | R34.1 v58.04,65.66 | v28.83,11.43 C41.1 IC27.4 | R80.1 v58.04,17.4 | IC2.3 120.9,66.04 118.75,68.2 C73.2 C75.2 v114.94,69.6 | IC15.4 C13.1 v47.37,65.66 | IC16.4 C15.1 v28.83,59.69
  Bottom 0.406: X10.3 8.89,37.47 26.04,20.32 26.04,14.22 v28.83,11.43 41.4,11.43 v47.37,17.4 v58.04,17.4 | v47.37,65.66 v58.04,65.66 61.98,69.6 v114.94,69.6 | v28.83,59.69 41.4,59.69 v47.37,65.66 | v47.37,65.66 v47.37,53.34 | v47.37,50.16 v47.37,33.66
-15V
  Top 0.406: C65.2 C71.2 123.57,69.6 124.59,68.58 IC2.2 128.91,68.58 132.72,64.77 148.59,64.77 149.86,66.04 X2.B10 X2.A10
A
  Top 0.406: D2.C 33.61,94.3 IC6.4
A2
  Top 0.406: D16.C 33.61,46.04 IC22.4
B
  Top 0.406: D3.A 33.61,89.86 IC5.4
B2
  Top 0.406: D17.A 33.61,41.59 IC21.4
C
  Top 0.406: IC9.4 67.82,90.81 67.5,90.48 D5.1 65.34,90.48 65.02,90.81 R21.2 R20.2 61.98,89.92 62.21,89.68 D4.C 62.21,65.04 71.37,55.88 R23.1
C2
  Top 0.406: IC19.4 67.82,42.55 67.5,42.23 D14.1 65.34,42.23 65.02,42.55 R69.2 R68.2 61.98,41.66 62.21,41.42 D18.C 62.21,16.78 71.37,7.62 R70.1
FOUT
  Top 0.406: IC17.11 X6.2 11.43,88.9 8.89,86.36 8.89,82.8 18.03,73.66 R1.2
FOUT2
  Top 0.406: IC25.11 X10.2 11.43,40.64 8.89,38.1 8.89,37.08 8.89,34.54 18.03,25.4 R84.2
GND  (via drill 0.35)
  Top 0.406: v22.86,93.34 IC17.7 26.04,93.34 26.99,94.3 IC6.3 | IC4.3 28.55,83.2 v28.57,83.19 | IC5.3 28.57,89.83 v28.57,88.9 | IC7.3 30.16,80.96 v29.84,81.28 | LED2.C v45.34,87.38 R15.1 | R13.1 v43.94,90.81 | R18.1 v55.88,84.84 | R21.1 v64.14,87.63 | D6.3 v69.85,85.72 | IC9.2 v75.56,93.34 | IC9.5 78.74,90.73 v78.74,89.53 | C16.2 v18.41,81.03 | v36.2,91.69 C18.2 | v36.2,96.27 C17.2 | C20.2 v23.88,78.99 | C19.2 v36.2,86.11 | v69.22,55.24 C8.1 67.69,56.13 67.31,56.52 IC8.4 | C21.2 v63.12,51.05 | R27.1 v55.88,58.17 55.71,58.34 D7.1 | IC15.3 48.9,58.42 49.15,58.67 C13.2 v50.42,59.69 | C12.1 v34.67,56.52 | IC16.3 30.23,57.15 30.61,57.53 C15.2 v31.75,58.42 | C14.1 v16.26,54.61 | C22.2 v80.64,96.52 | v22.86,45.09 IC25.7 26.04,45.09 26.99,46.04 IC22.3 | IC20.3 28.55,34.95 v28.57,34.92 | IC21.3 28.57,41.58 v28.57,40.64 | IC23.3 30.16,32.7 v29.84,33.02 | LED6.C v45.34,39.12 R67.1 | R65.1 v43.94,42.55 | R57.1 v55.88,36.58 | R69.1 v64.14,39.37 | D15.3 v69.85,37.47 | IC19.5 78.74,42.47 v78.74,41.27 | C42.2 v18.41,32.77 | v36.2,43.43 C44.2 | v36.2,48.01 C43.2 | C46.2 v23.88,30.73 | C45.2 v36.2,37.85 | v69.22,6.99 C37.1 67.69,7.87 67.31,8.26 IC24.4 | C47.2 v63.12,2.79 | R73.1 v55.88,9.91 55.71,10.08 D19.1 | IC26.3 48.9,10.16 49.15,10.41 C39.2 v50.42,11.43 | C38.1 v34.67,8.26 | IC27.3 30.23,8.89 30.61,9.27 C41.2 v31.75,10.16 | C40.1 v16.26,6.35 | IC19.2 v75.56,45.09 | C48.2 v84.07,46.99 | C75.1 C73.1 C65.1 C71.1 123.44,71.37 123.7,71.12 IC2.1 | C64.2 C70.2 122.56,50.8 | C72.2 C74.2 122.56,50.8 | IC1.2 122.56,50.8
  pour Bottom: 1.27,1.27 1.27,97.79 157.48,97.79 157.48,1.27
N$1
  Top 0.406: IC9.6 81.03,92.08 C9.1
N$2
  Top 0.406: X5.1 R1.1
N$7  (via drill 0.35)
  Top 0.406: IC17.13 20.32,87 v20.95,86.36 | IC4.4 32.19,84.14 v32.26,84.07 | IC17.1 24.66,84.99 v23.75,84.07
  Bottom 0.406: v20.95,86.36 21.46,86.36 v23.75,84.07 v32.26,84.07
N$9
  Top 0.406: R31.1 19.05,62.87 19.68,63.5 R7.3
N$10  (via drill 0.35)
  Top 0.406: IC17.9 v20.32,92.08 | IC4.2 v29.84,85.09
  Bottom 0.406: v29.84,85.09 24.13,85.09 20.95,88.27 20.95,91.44 v20.32,92.08
N$12
  Top 0.406: IC6.2 22.86,95.25 20.95,93.34 IC17.8
N$13  (via drill 0.35)
  Top 0.406: R22.1 R23.2 v69.6,52.07 | v61.85,62.61 C11.1
  Bottom 0.406: v69.6,52.07 61.85,59.82 v61.85,62.61
N$15  (via drill 0.35)
  Top 0.406: IC17.5 IC5.2 29.21,90.81 v29.84,91.44 | IC4.1 29.52,86.04 v29.84,86.36
  Bottom 0.406: v29.84,86.36 v29.84,91.44
N$16
  Top 0.406: R22.2 C8.2 IC8.3
N$17
  Top 0.406: C9.2 81.03,93.34 IC9.7
N$18
  Top 0.406: R24.1 R25.3
N$19
  Top 0.406: D5.3 68.41,87.71 67.31,86.61 66.27,86.61 D6.1
N$20
  Top 0.406: T1.C 41.91,92.33 | 41.91,92.33 T2.3 | 41.91,92.33 41.94,92.35 49.51,92.35 C7.1 R16.1
N$21
  Top 0.406: D3.C 37.08,89.79 38.14,88.73 T2.2 41.02,88.79 R13.2
N$23
  Top 0.406: R14.2 LED1.C 45.27,95.08 T1.B
N$24
  Top 0.406: R14.1 LED2.A 44.69,89.9 43.52,88.73 T2.1
N$25
  Top 0.406: C7.2 R15.2
N$26
  Top 0.406: R17.1 Q1.C
N$27
  Top 0.406: Q1.B 54.06,89.7 53.59,90.17 R16.2
N$28
  Top 0.406: R18.2 55.88,89.41 56.18,89.7 Q1.E 57.95,89.7 59.05,90.81 R20.1 60.2,89.92 59.71,89.43 D4.A
N$29
  Top 0.406: IC9.3 75.44,92.08 76.2,91.31 R24.2
N$30  (via drill 0.35)
  Top 0.406: IC9.1 R19.1 71.37,92.96 v71.12,92.71 | v33.66,80.01 IC7.2
  Bottom 0.406: v71.12,92.71 49.53,92.71 36.83,80.01 v33.66,80.01
N$31
  Top 0.406: C11.2 C10.2 R26.1 60.07,55.63 59.69,55.24 IC8.6 R27.2 R28.1
N$32
  Top 0.406: IC8.2 62.23,53.98 61.85,54.36 R26.2 C10.1
N$33
  Top 0.406: R28.2 47.37,57.02 | 47.37,57.02 R29.2 | 47.37,57.02 47.24,57.15 IC15.2 43.81,57.15 43.43,57.53 R33.1
N$34
  Top 0.406: IC16.6 R32.1 19.3,57.91 19.05,58.17 R31.2
N$35
  Top 0.406: R7.1 R7.2 24.77,60.33 24.77,56.52 25.4,55.88 IC16.2 32.38,55.88 34.92,58.42 R30.2
N$36
  Top 0.406: R32.2 X4.1
N$37
  Top 0.406: R33.2 41.66,58.8 41.27,58.42 IC15.6 R30.1
N$38
  Top 0.406: R34.2 55.5,63.88 | 55.5,63.88 R36.2 | 55.5,63.88 55.71,63.67 D7.2
N$39
  Top 0.406: R35.2 53.98,71.75 52.07,69.85 52.07,58.42 50.8,57.15 R29.1
N$40
  Top 0.406: R36.1 R35.3
N$41
  Top 0.406: R12.1 40.96,97.09 T1.E 40.96,94.23 D2.A
N$68  (via drill 0.35)
  Top 0.406: IC25.13 20.32,38.73 v20.95,38.1 | IC20.4 32.19,35.88 v32.26,35.81 | IC25.1 24.66,36.73 v23.75,35.81
  Bottom 0.406: v20.95,38.1 21.46,38.1 v23.75,35.81 v32.26,35.81
N$69
  Top 0.406: IC17.4 22.48,89.53 | 22.48,89.53 22.35,89.53 21.08,90.81 IC17.10 | 22.48,89.53 22.48,88.27 | 22.48,88.27 22.48,87 | 22.48,87 IC17.2 | IC17.12 22.48,88.27 | R11.1 22.48,87
N$70  (via drill 0.35)
  Top 0.406: IC25.9 v20.32,43.81 | IC20.2 v29.84,36.83
  Bottom 0.406: v29.84,36.83 24.13,36.83 20.95,40.01 20.95,43.18 v20.32,43.81
N$71
  Top 0.406: IC22.2 22.86,46.99 20.95,45.09 IC25.8
N$72  (via drill 0.35)
  Top 0.406: IC25.5 IC21.2 v29.84,42.55 | IC20.1 29.52,37.78 v29.84,38.1
  Bottom 0.406: v29.84,38.1 v29.84,42.55
N$73
  Top 0.406: R60.1 R61.3
N$74
  Top 0.406: D14.3 68.41,39.45 67.31,38.35 66.27,38.35 D15.1
N$75
  Top 0.406: T6.C 41.91,44.07 | 41.91,44.07 T5.3 | 41.91,44.07 41.94,44.09 49.51,44.09 C34.1 R63.1
N$76
  Top 0.406: D17.C 37.08,41.53 38.14,40.47 T5.2 41.02,40.53 R65.2
N$77
  Top 0.406: R66.2 LED5.C 45.27,46.82 T6.B
N$78
  Top 0.406: R66.1 LED6.A 44.69,41.64 43.52,40.47 T5.1
N$79
  Top 0.406: C34.2 R67.2
N$80
  Top 0.406: R64.1 Q3.C
N$81
  Top 0.406: Q3.B 54.06,41.45 53.59,41.91 R63.2
N$82
  Top 0.406: R57.2 55.88,41.15 56.18,41.45 Q3.E 57.95,41.45 59.05,42.55 R68.1 60.2,41.66 59.71,41.17 D18.A
N$83
  Top 0.406: IC19.3 75.44,43.81 76.2,43.05 R60.2
N$84
  Top 0.406: IC19.6 81.03,43.81 C33.1
N$85
  Top 0.406: C33.2 81.03,45.09 IC19.7
N$86  (via drill 0.35)
  Top 0.406: IC19.1 R59.1 71.37,44.7 v71.12,44.45 | v33.66,31.75 IC23.2
  Bottom 0.406: v71.12,44.45 59.82,44.45 47.12,31.75 v33.66,31.75
N$87  (via drill 0.35)
  Top 0.406: R71.1 R70.2 v69.6,3.81 | v61.85,14.35 C36.1
  Bottom 0.406: v69.6,3.81 61.85,11.56 v61.85,14.35
N$88
  Top 0.406: R71.2 C37.2 IC24.3
N$89
  Top 0.406: C36.2 C35.2 R72.1 60.07,7.37 59.69,6.99 IC24.6 R73.2 R74.1
N$90
  Top 0.406: IC24.2 62.23,5.71 61.85,6.1 R72.2 C35.1
N$91
  Top 0.406: R74.2 47.37,8.76 | 47.37,8.76 R75.2 | 47.37,8.76 47.24,8.89 IC26.2 43.81,8.89 43.43,9.27 R79.1
N$92
  Top 0.406: R83.1 R83.2 24.77,12.06 24.77,8.26 25.4,7.62 IC27.2 32.38,7.62 34.92,10.16 R76.2
N$93
  Top 0.406: IC27.6 R78.1 19.3,9.65 19.05,9.91 R77.2
N$94
  Top 0.406: R78.2 X8.1
N$95
  Top 0.406: R79.2 41.66,10.54 41.27,10.16 IC26.6 R76.1
N$96
  Top 0.406: R80.2 55.5,15.62 | 55.5,15.62 R82.2 | 55.5,15.62 55.71,15.41 D19.2
N$97
  Top 0.406: R81.2 53.98,23.5 52.07,21.59 52.07,10.16 50.8,8.89 R75.1
N$98
  Top 0.406: R82.1 R81.3
N$99
  Top 0.406: R77.1 19.05,14.61 19.68,15.24 R83.3
N$100
  Top 0.406: R62.1 40.96,48.83 T6.E 40.96,45.97 D16.A
N$101
  Top 0.406: X9.1 R84.1
N$102
  Top 0.406: IC25.4 22.48,41.27 | 22.48,41.27 22.35,41.27 21.08,42.55 IC25.10 | 22.48,41.27 22.48,40.01 | 22.48,40.01 22.48,38.73 | 22.48,38.73 IC25.2 | IC25.12 22.48,40.01 | R58.1 22.48,38.73
PLL_OUT
  Top 0.406: IC17.3 25.91,88.27 27.3,86.87 27.3,81.15 27.5,80.96 IC7.4
PLL_OUT2
  Top 0.406: IC25.3 25.91,40.01 27.3,38.61 27.3,32.89 27.5,32.7 IC23.4

### Text on the board
tNames: CCM_0020 floating pA ammeter revB / 2-channel translator (f to v) / Nov. 2019 / N. Fitch | Frequency output | Analog output | Frequency output | Analog output